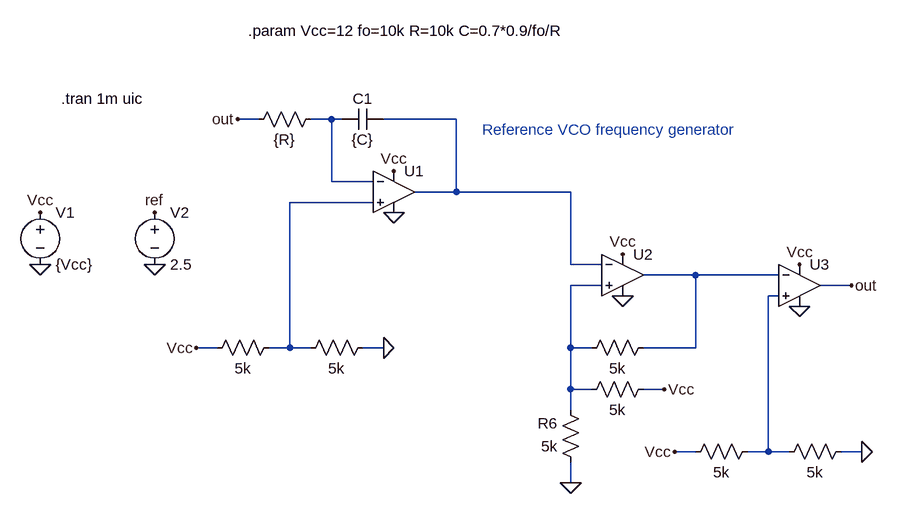
[diagram p0: schematic Oscilateur.asc]
Oscilateur.asc, the LTspice schematic file:
Version 4
SHEET 1 880 680
WIRE -96 -144 -128 -144
WIRE 16 -144 -16 -144
WIRE 32 -144 16 -144
WIRE 208 -144 96 -144
WIRE 16 -48 16 -144
WIRE 80 -48 16 -48
WIRE 208 -32 208 -144
WIRE 208 -32 144 -32
WIRE 384 -32 208 -32
WIRE 80 -16 -48 -16
WIRE 384 80 384 -32
WIRE 432 80 384 80
WIRE 576 96 496 96
WIRE 704 96 576 96
WIRE 432 112 384 112
WIRE 816 112 768 112
WIRE 704 128 688 128
WIRE -160 208 -192 208
WIRE -48 208 -48 -16
WIRE -48 208 -80 208
WIRE -16 208 -48 208
WIRE 96 208 64 208
WIRE 384 208 384 112
WIRE 416 208 384 208
WIRE 576 208 576 96
WIRE 576 208 496 208
WIRE 384 272 384 208
WIRE 416 272 384 272
WIRE 528 272 496 272
WIRE 384 304 384 272
WIRE 576 368 544 368
WIRE 688 368 688 128
WIRE 688 368 656 368
WIRE 720 368 688 368
WIRE 832 368 800 368
WIRE 384 416 384 384
FLAG -192 208 Vcc
FLAG 464 64 Vcc
FLAG 464 128 0
FLAG 96 208 0
FLAG -128 -144 out
FLAG 816 112 out
FLAG -432 0 Vcc
FLAG -432 80 0
FLAG -256 80 0
FLAG -256 0 ref
FLAG 384 416 0
FLAG 528 272 Vcc
FLAG 112 0 0
FLAG 112 -64 Vcc
FLAG 736 80 Vcc
FLAG 736 144 0
FLAG 544 368 Vcc
FLAG 832 368 0
SYMBOL res -64 192 R90
WINDOW 0 0 56 Invisible 2
WINDOW 3 32 56 VTop 2
SYMATTR InstName R1
SYMATTR Value 5k
SYMBOL res 80 192 R90
WINDOW 0 0 56 Invisible 2
WINDOW 3 32 56 VTop 2
SYMATTR InstName R2
SYMATTR Value 5k
SYMBOL res 0 -160 R90
WINDOW 0 0 56 Invisible 2
WINDOW 3 32 56 VTop 2
SYMATTR InstName R5
SYMATTR Value {R}
SYMBOL cap 32 -128 R270
WINDOW 0 32 32 VTop 2
WINDOW 3 0 32 VBottom 2
SYMATTR InstName C1
SYMATTR Value {C}
SYMBOL voltage -432 -16 R0
SYMATTR InstName V1
SYMATTR Value {Vcc}
SYMBOL voltage -256 -16 R0
WINDOW 123 0 0 Left 0
WINDOW 39 0 0 Left 0
SYMATTR InstName V2
SYMATTR Value 2.5
SYMBOL res 512 256 R90
WINDOW 0 0 56 Invisible 2
WINDOW 3 32 56 VTop 2
SYMATTR InstName R3
SYMATTR Value 5k
SYMBOL res 512 192 R90
WINDOW 0 0 56 Invisible 2
WINDOW 3 32 56 VTop 2
SYMATTR InstName R4
SYMATTR Value 5k
SYMBOL res 400 400 R180
WINDOW 0 36 76 Left 2
WINDOW 3 36 40 Left 2
SYMATTR InstName R6
SYMATTR Value 5k
SYMBOL OpAmps\\UniversalOpAmp2 112 -32 R0
SYMATTR InstName U1
SYMBOL OpAmps\\UniversalOpAmp2 736 112 R0
SYMATTR InstName U3
SYMBOL res 672 352 R90
WINDOW 0 0 56 Invisible 2
WINDOW 3 32 56 VTop 2
SYMATTR InstName R7
SYMATTR Value 5k
SYMBOL res 816 352 R90
WINDOW 0 0 56 Invisible 2
WINDOW 3 32 56 VTop 2
SYMATTR InstName R8
SYMATTR Value 5k
SYMBOL OpAmps\\UniversalOpAmp2 464 96 R0
SYMATTR InstName U2
TEXT 248 -128 Left 2 ;Reference VCO frequency generator
TEXT -400 -176 Left 2 !.tran 1m uic
TEXT -112 -280 Left 2 !.param Vcc=12 fo=10k R=10k C=0.7*0.9/fo/R

The netlist it stands for:
* Oscilateur.asc
R1 N003 Vcc 5k
R2 0 N003 5k
R5 N001 out {R}
C1 N001 N002 {C}
V1 Vcc 0 {Vcc}
V2 ref 0 2.5
R3 Vcc N005 5k
R4 N004 N005 5k
R6 0 N005 5k
XU1 N003 N001 Vcc 0 N002 level2 Avol=1Meg GBW=10Meg Slew=10Meg Ilimit=25m Rail=0 Vos=0 En=0 Enk=0 In=0 Ink=0 Rin=500Meg  ; pins In+ In- V+ V- OUT
XU3 N006 N004 Vcc 0 out level2 Avol=1Meg GBW=10Meg Slew=10Meg Ilimit=25m Rail=0 Vos=0 En=0 Enk=0 In=0 Ink=0 Rin=500Meg  ; pins In+ In- V+ V- OUT
R7 N006 Vcc 5k
R8 0 N006 5k
XU2 N005 N002 Vcc 0 N004 level2 Avol=1Meg GBW=10Meg Slew=10Meg Ilimit=25m Rail=0 Vos=0 En=0 Enk=0 In=0 Ink=0 Rin=500Meg  ; pins In+ In- V+ V- OUT
* Reference VCO frequency generator
.tran 1m uic
.param Vcc=12 fo=10k R=10k C=0.7*0.9/fo/R
.lib UniversalOpAmp2.lib
.backanno
.end